# Altium schematic sheet Power Distribution - Driver Display and Interior Fan.SchDoc: Title
size B; Organization: Midnight Sun Solar Rayce Car Team; Address1: University of Waterloo; Address2: 200 University Ave W; Address3: Waterloo, ON, Canada; Address4: N2L 3E9; Website: www.uwmidsun.com; ProjectName: ProjectName
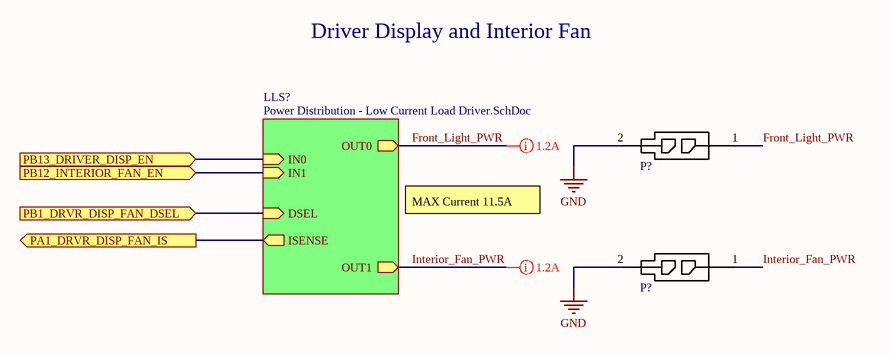
[diagram p0: Power Distribution - Driver Display and Interior Fan.SchDoc]

## Parts
(Parts that share a designator on the sheet are numbered #1, #2 ... from top to bottom, then left to right.)
P?#1  CONN 2POS MICRO-FIT 3mm  [CONN, 2POS MICRO-FIT]  (value not drawn)
P?#2  CONN 2POS MICRO-FIT 3mm  [CONN, 2POS MICRO-FIT]  (value not drawn)

## Sub-sheets
LLS? = Power Distribution - Low Current Load Driver.SchDoc: IN0 (in), IN1 (in), DSEL (in), ISENSE (out), OUT0 (out), OUT1 (out)

## Ports
PA1_DRVR_DISP_FAN_IS (out), PB1_DRVR_DISP_FAN_DSEL (in), PB12_INTERIOR_FAN_EN (in), PB13_DRIVER_DISP_EN (in)

## Nets
GND: P?#1.2 P?#2.2
Front_Light_PWR: P?#1.1 ; sheet LLS?/OUT0
Interior_Fan_PWR: P?#2.1 ; sheet LLS?/OUT1
PA1_DRVR_DISP_FAN_IS: port PA1_DRVR_DISP_FAN_IS, sheet LLS?/ISENSE
PB1_DRVR_DISP_FAN_DSEL: port PB1_DRVR_DISP_FAN_DSEL, sheet LLS?/DSEL
PB12_INTERIOR_FAN_EN: port PB12_INTERIOR_FAN_EN, sheet LLS?/IN1
PB13_DRIVER_DISP_EN: port PB13_DRIVER_DISP_EN, sheet LLS?/IN0

## Layout directives
mark named 1.2A: Front_Light_PWR, Interior_Fan_PWR

## Notes on the sheet
- Driver Display and Interior Fan
- MAX Current 11.5A
- PROJECT
- DOCUMENT
- DRAWN BY
- LAST MODIFIED
- PART NUMBER
- REVISION
- SHEET
- VARIANT
- OF
- Engineering 5 - 1002
  University of Waterloo
  (519) 888-4567 x32978
  hardware@uwmidsun.com

## Library data of the parts
P?#1 P?#2 = CONN 2POS MICRO-FIT 3mm: Connector Header Through Hole 2 position; Manufacturer: Molex; Manufacturer Part Number: 43045-0227; Number of Positions: 2; Gender: Male; Contact Resistance: 10mR; Number of Ports: 1; Max Voltage Rating (DC): 250.25kV; Current Rating: 5A; Voltage Rating: 600V; Glow Wire Compliant: Compliant; Supplier 1: Digi-Key; Stock 1: 3657; Pricing 1: 1=0.84, 10=0.74, 25=0.6968, 50=0.6676, 100=0.6387, 250=0.5806, 500=0.52254, 1000=0.46448, 2500=0.42094 (USD); Mount: Through Hole; Contact Plating: Tin; Contact Material: Brass; Housing Colour: Black; Housing Material: Thermoplastic; Number of Terminals: 2; Min Operating Temperature: -40°C; Max Operating Temperature: 105°C; Number of Rows: 2; Packaging: Tray; Termination: Solder; Number of Contacts: 2; Orientation: Vertical; Package Quantity: 3168; Number of Circuits: 2; Length: 7.15mm; Pitch: 3mm; Depth: 8.77mm; Row Spacing: 3mm; Radiation Hardening: No; Halogen Free: Low Halogen; ComponentLink1URL: http://www.onlinecomponents.com/productFiles/mf-MOL/307170430450227_pcb_headers.pdf; ComponentLink1Description: http://www.onlinecomponents.com/productFiles/mf-MOL/307170430450227_pcb_headers.pdf; ComponentLink2URL: http://www.mouser.com/ds/2/276/0430450227_PCB_HEADERS-142611.pdf; ComponentLink2Description: http://www.mouser.com/ds/2/276/0430450227_PCB_HEADERS-142611.pdf; ComponentLink3URL: http://uk.rs-online.com/webdocs/13c3/0900766b813c3a46.pdf; ComponentLink3Description: http://uk.rs-online.com/webdocs/13c3/0900766b813c3a46.pdf; ComponentLink4URL: http://www.molex.com/webdocs/datasheets/pdf/en-us/0430450227_PCB_HEADERS.pdf; ComponentLink4Description: http://www.molex.com/webdocs/datasheets/pdf/en-us/0430450227_PCB_HEADERS.pdf; Supplier Part Number 1: WM10657-ND